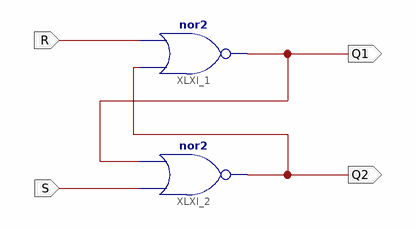
[diagram p0: schematic sheet 1]
// Xilinx ISE schematic Lab7Exp1.sch (spartan3e) as structural Verilog: 2 symbols, 4 ports
module Lab7Exp1 (
  input  S,
  input  R,
  output Q1,
  output Q2
);

  nor XLXI_1 (Q1, Q2, R);
  nor XLXI_2 (Q2, S, Q1);
endmodule
